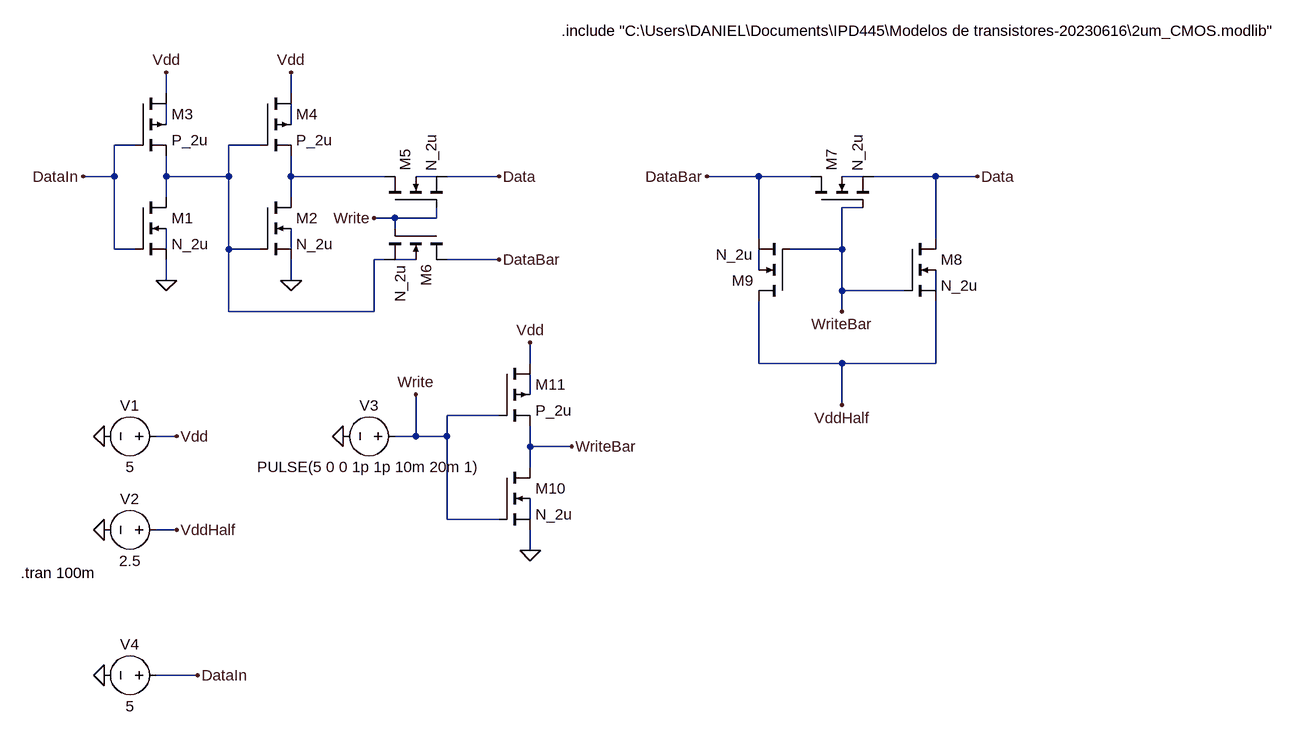
[diagram p0: schematic Drivers.asc]
Drivers.asc, the LTspice schematic file:
Version 4
SHEET 1 1876 976
WIRE 48 16 48 -16
WIRE 240 16 240 -16
WIRE 48 64 48 32
WIRE 240 64 240 32
WIRE 0 96 -32 96
WIRE 192 96 144 96
WIRE -32 144 -32 96
WIRE -32 144 -80 144
WIRE 48 144 48 112
WIRE 144 144 144 96
WIRE 144 144 48 144
WIRE 240 144 240 112
WIRE 384 144 240 144
WIRE 464 144 432 144
WIRE 560 144 480 144
WIRE 960 144 880 144
WIRE 1040 144 960 144
WIRE 1120 144 1088 144
WIRE 1232 144 1136 144
WIRE 1296 144 1232 144
WIRE 48 176 48 144
WIRE 240 176 240 144
WIRE 1120 192 1088 192
WIRE 400 208 368 208
WIRE 464 208 464 192
WIRE 464 208 400 208
WIRE 400 224 400 208
WIRE 960 240 960 144
WIRE 1232 240 1232 144
WIRE -32 256 -32 144
WIRE 0 256 -32 256
WIRE 48 256 48 224
WIRE 144 256 144 144
WIRE 192 256 144 256
WIRE 240 256 240 224
WIRE 1088 256 1088 192
WIRE 1088 256 1008 256
WIRE 384 272 368 272
WIRE 432 272 400 272
WIRE 560 272 480 272
WIRE 960 288 960 256
WIRE 48 304 48 272
WIRE 240 304 240 272
WIRE 1088 320 1088 256
WIRE 1184 320 1088 320
WIRE 1232 320 1232 288
WIRE 144 352 144 256
WIRE 368 352 368 272
WIRE 368 352 144 352
WIRE 1088 352 1088 320
WIRE 608 432 608 400
WIRE 960 432 960 336
WIRE 1088 432 960 432
WIRE 1232 432 1232 336
WIRE 1232 432 1088 432
WIRE 608 480 608 448
WIRE 1088 496 1088 432
WIRE 560 512 480 512
WIRE 64 544 32 544
WIRE 432 544 432 480
WIRE 432 544 400 544
WIRE 480 544 480 512
WIRE 480 544 432 544
WIRE 608 560 608 528
WIRE 672 560 608 560
WIRE 608 592 608 560
WIRE 480 672 480 544
WIRE 560 672 480 672
WIRE 608 672 608 640
WIRE 64 688 32 688
WIRE 608 720 608 688
WIRE 96 912 32 912
FLAG 48 304 0
FLAG 240 304 0
FLAG 48 -16 Vdd
FLAG 240 -16 Vdd
FLAG 368 208 Write
FLAG -80 144 DataIn
FLAG 560 144 Data
FLAG 560 272 DataBar
FLAG 1088 496 VddHalf
FLAG 1088 352 WriteBar
FLAG 880 144 DataBar
FLAG 1296 144 Data
FLAG -48 544 0
FLAG -48 688 0
FLAG 64 544 Vdd
FLAG 64 688 VddHalf
FLAG 320 544 0
FLAG 608 720 0
FLAG 608 400 Vdd
FLAG 432 480 Write
FLAG 672 560 WriteBar
FLAG -48 912 0
FLAG 96 912 DataIn
SYMBOL nmos4 0 176 R0
SYMATTR InstName M1
SYMATTR Value N_2u
SYMATTR Value2 l=2u w=8u
SYMBOL nmos4 192 176 R0
SYMATTR InstName M2
SYMATTR Value N_2u
SYMATTR Value2 l=2u w=8u
SYMBOL pmos4 0 16 R0
SYMATTR InstName M3
SYMATTR Value P_2u
SYMATTR Value2 l=2u w=12u
SYMBOL pmos4 192 16 R0
SYMATTR InstName M4
SYMATTR Value P_2u
SYMATTR Value2 l=2u w=12u
SYMBOL nmos4 384 192 R270
SYMATTR InstName M5
SYMATTR Value N_2u
SYMATTR Value2 l=2u w=8u
SYMBOL nmos4 480 224 R90
SYMATTR InstName M6
SYMATTR Value N_2u
SYMATTR Value2 l=2u w=8u
SYMBOL nmos4 1040 192 R270
SYMATTR InstName M7
SYMATTR Value N_2u
SYMATTR Value2 l=2u w=8u
SYMBOL nmos4 1184 240 R0
SYMATTR InstName M8
SYMATTR Value N_2u
SYMATTR Value2 l=2u w=8u
SYMBOL nmos4 1008 336 R180
SYMATTR InstName M9
SYMATTR Value N_2u
SYMATTR Value2 l=2u w=8u
SYMBOL voltage 48 544 R90
WINDOW 0 -32 56 VBottom 2
WINDOW 3 32 56 VTop 2
WINDOW 123 0 0 Left 0
WINDOW 39 0 0 Left 0
SYMATTR InstName V1
SYMATTR Value 5
SYMBOL voltage 48 688 R90
WINDOW 0 -32 56 VBottom 2
WINDOW 3 32 56 VTop 2
WINDOW 123 0 0 Left 0
WINDOW 39 0 0 Left 0
SYMATTR InstName V2
SYMATTR Value 2.5
SYMBOL voltage 416 544 R90
WINDOW 0 -32 56 VBottom 2
WINDOW 3 32 56 VTop 2
WINDOW 123 0 0 Left 0
WINDOW 39 0 0 Left 0
SYMATTR InstName V3
SYMATTR Value PULSE(5 0 0 1p 1p 10m 20m 1)
SYMBOL nmos4 560 592 R0
SYMATTR InstName M10
SYMATTR Value N_2u
SYMATTR Value2 l=2u w=8u
SYMBOL pmos4 560 432 R0
SYMATTR InstName M11
SYMATTR Value P_2u
SYMATTR Value2 l=2u w=12u
SYMBOL voltage 48 912 R90
WINDOW 0 -32 56 VBottom 2
WINDOW 3 32 56 VTop 2
WINDOW 123 0 0 Left 0
WINDOW 39 0 0 Left 0
SYMATTR InstName V4
SYMATTR Value 5
TEXT 656 -80 Left 2 !.include "C:\\Users\\DANIEL\\Documents\\IPD445\\Modelos de transistores-20230616\\2um_CMOS.modlib"
TEXT -176 754 Left 2 !.tran 100m

The netlist it stands for:
* Drivers.asc
M1 N003 DataIn 0 N007 N_2u l=2u w=8u
M2 N004 N003 0 N008 N_2u l=2u w=8u
M3 Vdd DataIn N003 N001 P_2u l=2u w=12u
M4 Vdd N003 N004 N002 P_2u l=2u w=12u
M5 N004 Write Data N005 N_2u l=2u w=8u
M6 DataBar Write N003 N009 N_2u l=2u w=8u
M7 DataBar WriteBar Data N006 N_2u l=2u w=8u
M8 Data WriteBar VddHalf N011 N_2u l=2u w=8u
M9 VddHalf WriteBar DataBar N010 N_2u l=2u w=8u
V1 Vdd 0 5
V2 VddHalf 0 2.5
V3 Write 0 PULSE(5 0 0 1p 1p 10m 20m 1)
M10 WriteBar Write 0 N013 N_2u l=2u w=8u
M11 Vdd Write WriteBar N012 P_2u l=2u w=12u
V4 DataIn 0 5
.model NMOS NMOS
.model PMOS PMOS
.lib standard.mos
.include "C:\Users\DANIEL\Documents\IPD445\Modelos de transistores-20230616\2um_CMOS.modlib"
.tran 100m
.backanno
.end